# EAGLE design fonteauto4usb (EAGLE 4.16)
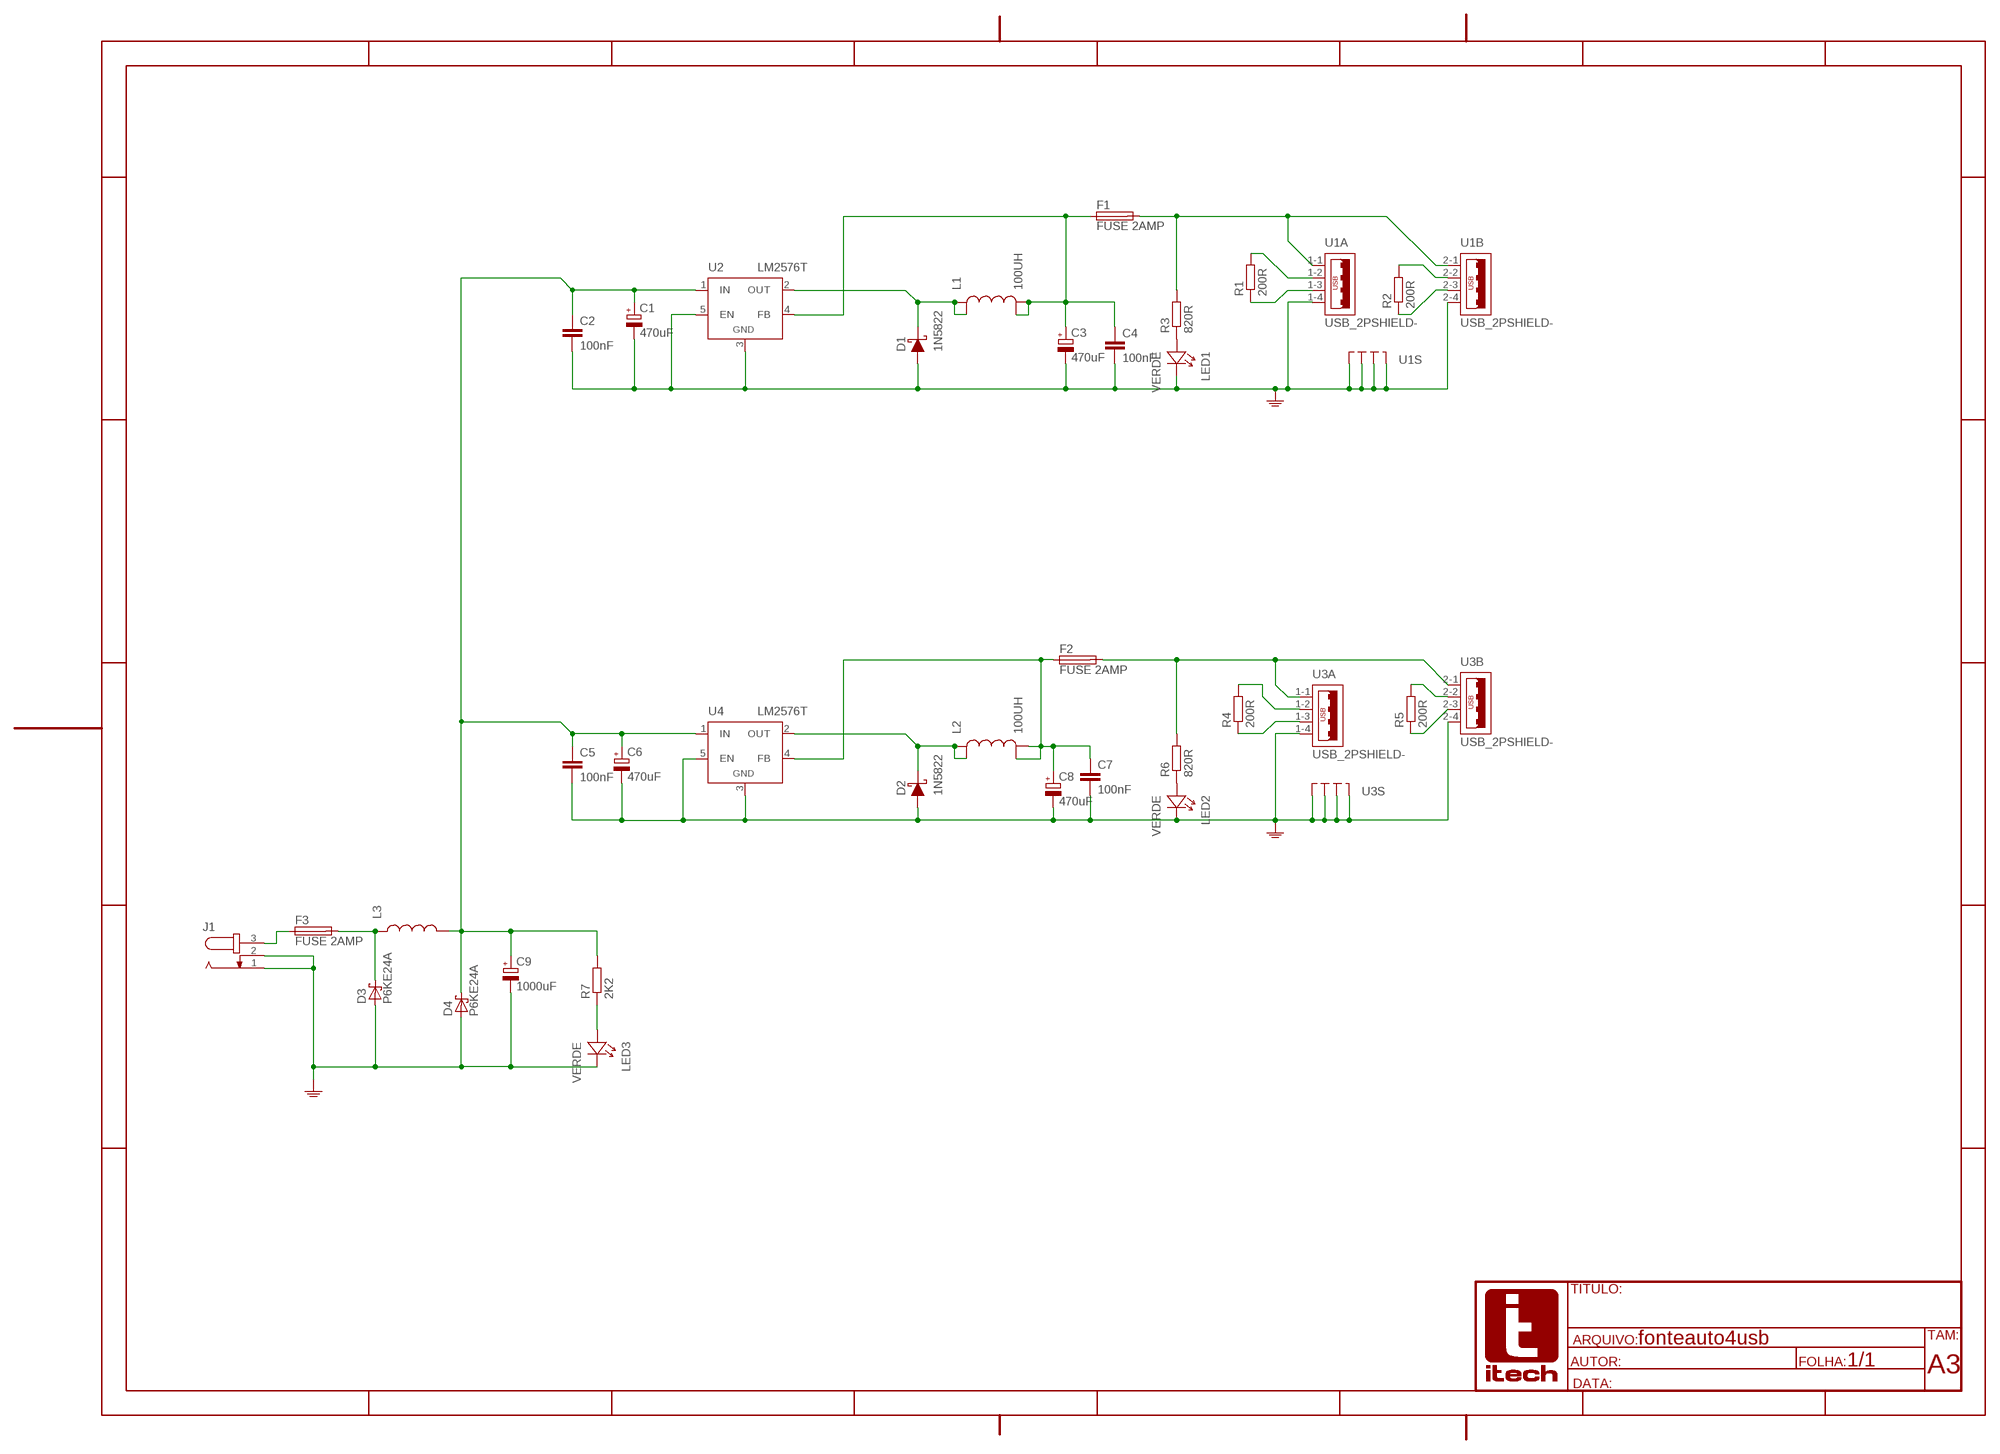
[diagram p0: schematic, sheet 1]

## Parts
C1  470uF  CPOL-EUE5-10.5  [E5-10,5]
C2  100nF  C-EU050-025X075  [C050-025X075]
C3  470uF  CPOL-EUE5-10.5  [E5-10,5]
C4  100nF  C-EU050-025X075  [C050-025X075]
C5  100nF  C-EU050-025X075  [C050-025X075]
C6  470uF  CPOL-EUE5-10.5  [E5-10,5]
C7  100nF  C-EU050-025X075  [C050-025X075]
C8  470uF  CPOL-EUE5-10.5  [E5-10,5]
C9  1000uF  CPOL-EUE5-10.5  [E5-10,5]
D1  1N5822  [DO201T15]
D2  1N5822  [DO201T15]
D3  P6KE24A  P6KEXXA  [C1702-15]
D4  P6KE24A  P6KEXXA  [C1702-15]
F1  FUSE 2AMP  FUSEKS9V  [KS9V]
F2  FUSE 2AMP  FUSEKS9V  [KS9V]
F3  FUSE 2AMP  FUSEKS9V  [KS9V]
J1  JACK-PLUG0  [SPC4077]
L1  100UH  [DS124]
L2  100UH  [DS124]
L3  PCV-2-103-5L  [PCV-2-103-5L]
LED1  VERDE  LED3MM  [LED3MM]
LED2  VERDE  LED3MM  [LED3MM]
LED3  VERDE  LED3MM  [LED3MM]
R1  200R  R-EU_0207/10  [0207/10]
R2  200R  R-EU_0207/10  [0207/10]
R3  820R  R-EU_0207/10  [0207/10]
R4  200R  R-EU_0207/10  [0207/10]
R5  200R  R-EU_0207/10  [0207/10]
R6  820R  R-EU_0207/10  [0207/10]
R7  2K2  R-EU_0207/10  [0207/10]
U1  USB_2PSHIELD-  [USB-2P]
U2  LM2576T  [TO220-51]
U3  USB_2PSHIELD-  [USB-2P]
U4  LM2576T  [TO220-51]

## Nets
GND: C1.- C2.2 C3.- C4.2 C5.2 C6.- C7.2 C8.- C9.- D1.A D2.A D3.A D4.A J1.1 J1.2 LED1.K LED2.K LED3.K U1.1-4 U1.2-4 U1.M1(S:S1) U1.M2(S:S2) U1.M3(S:S3) U1.M4(S:S4) U2.3(GND) U2.5(EN) U3.1-4 U3.2-4 U3.M1(S:S1) U3.M2(S:S2) U3.M3(S:S3) U3.M4(S:S4) U4.3(GND) U4.5(EN)
N$1: R2.2 U1.2-2
N$2: R2.1 U1.2-3
N$3: R1.1 U1.1-3
N$4: R1.2 U1.1-2
N$5: R5.1 U3.2-3
N$6: R5.2 U3.2-2
N$7: R4.1 U3.1-3
N$8: R4.2 U3.1-2
N$9: LED2.A R6.1
N$11: C7.1 C8.+ F2.1 L2.P$2 L2.P$4 U4.4(FB)
N$12: F3.1 J1.3
N$13: D2.C(K) L2.P$1 L2.P$3 U4.2(OUT)
N$14: C1.+ C2.1 C5.1 C6.+ C9.+ D4.C L3.2 R7.2 U2.1(IN) U4.1(IN)
N$15: F2.2 R6.2 U3.1-1 U3.2-1
N$16: D3.C F3.2 L3.1
N$17: F1.2 R3.2 U1.1-1 U1.2-1
N$18: LED3.A R7.1
N$19: LED1.A R3.1
N$26: C3.+ C4.1 F1.1 L1.P$2 L1.P$4 U2.4(FB)
N$28: D1.C(K) L1.P$1 L1.P$3 U2.2(OUT)

## Library data of the parts
C1 C3 C6 C8 C9 = rcl:CPOL-EU: POLARIZED CAPACITOR, European symbol
C2 C4 C5 C7 = rcl:C-EU: CAPACITOR, European symbol
D1 D2 = diodos:1N582*
D3 D4 = diode:P6KEXXA: DIODE transient-voltage suppressor
F1-F3 = fuse:FUSE: Fuse
J1 = con-jack:JACK-PLUG: DC POWER JACK Power Jack, DC, Right Angle, Through Hole, Rated 5A at 16VDC, PC Terminals Distributor: Farnell (www.Farnell.de) Drawing: 84N1161.pdf / 84N1162.pdf Manufacturer: SPC Technology (www.spctechnology.com) Type: SPC4077 / SPC 4078
L1 L2 = inductor-coilcraft:100UH
L3 = inductor-coilcraft:PCV-2-*
LED1-LED3 = leds:LED3MM: LED 3 MM
R1-R7 = rcl:R-EU_: RESISTOR, European symbol
U1 U3 = itech:USB_2PSHIELD-: Conector USB Type A Double Female 90°
U2 U4 = LM2XXX:LM2576T

## Board
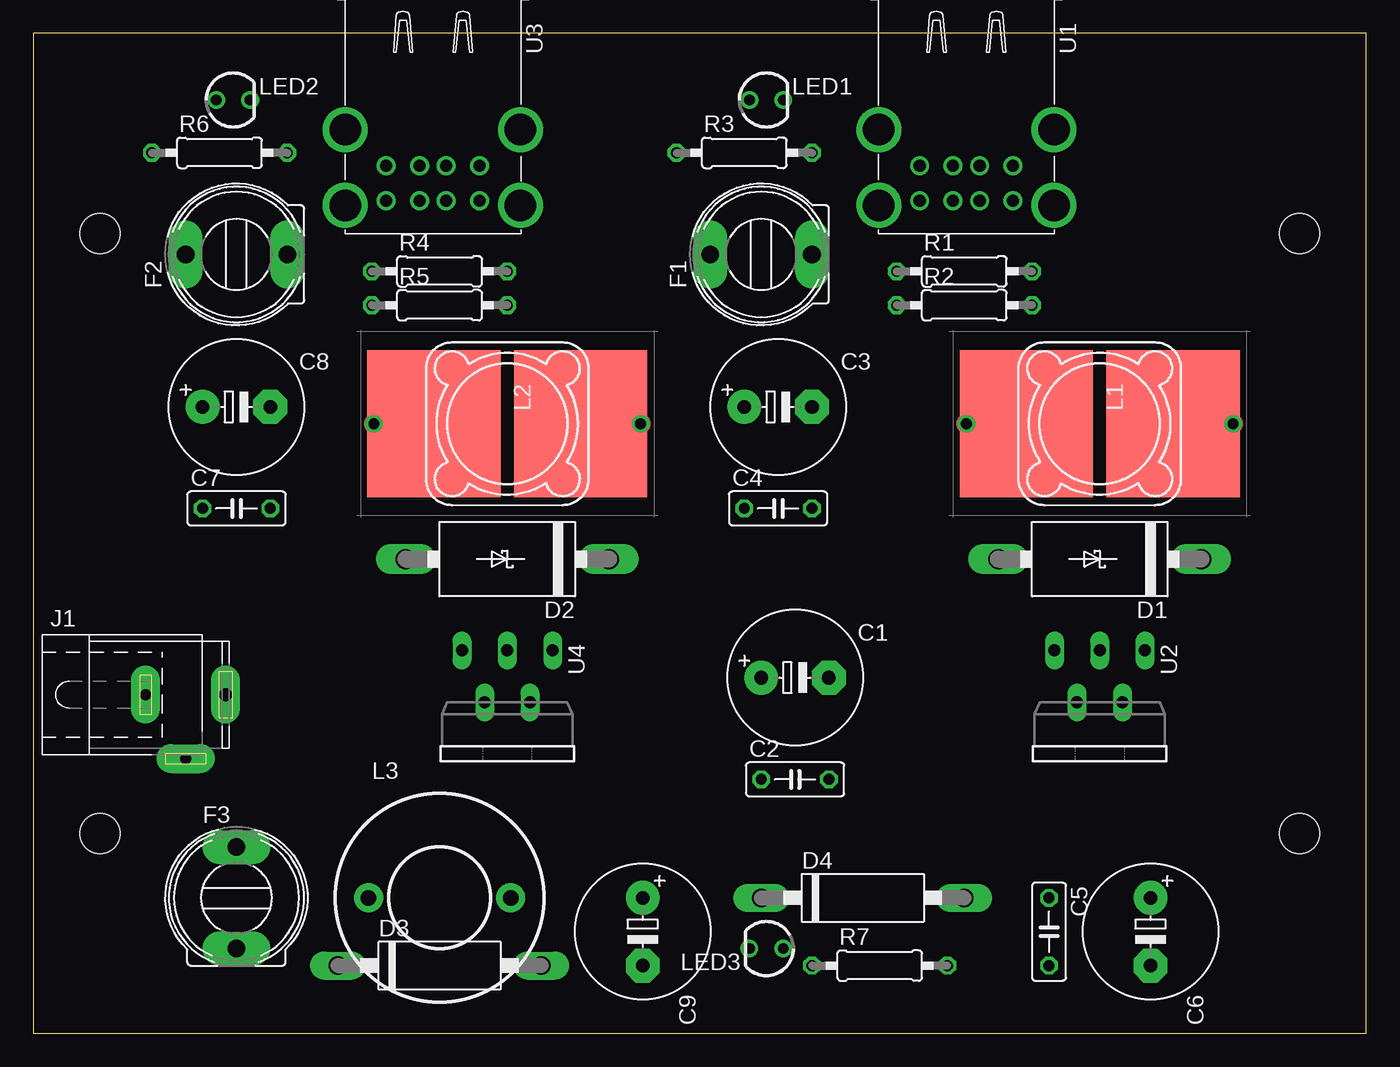
[diagram p1: board, top side]
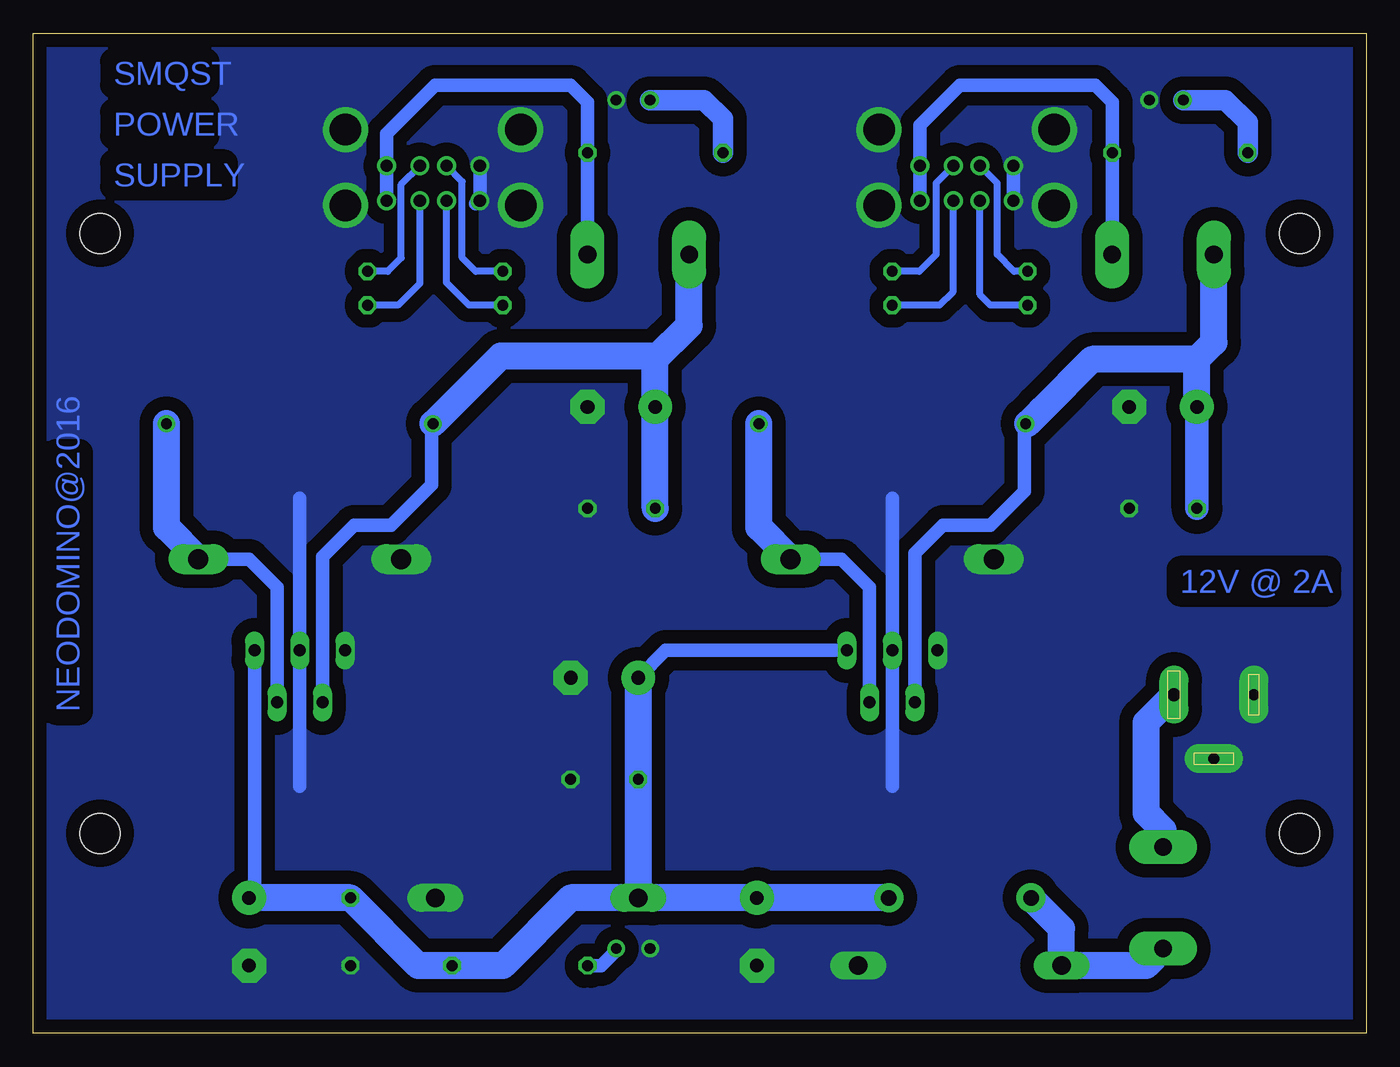
[diagram p2: board, bottom side, seen from below]

Size 100 x 75 mm. Coordinates in mm from the lower left corner, seen from the top.
Outline: 0,0 100,0 100,75 0,75 0,0
Copper layers (1*16): Top 0.035mm / dielectric 1.5mm / Bottom 0.035mm
Design rules "default": minimum track width 10mil, minimum drill 24mil, track to track 8mil, track to pad 8mil, pad to pad 8mil, via to via 8mil, smd to smd 8mil, copper to edge 40mil, drill to drill 8mil, minimum pad ring 10mil, minimum via ring 8mil, stop-mask expansion 4mil, vias tented up to drill 0mil, thermal gap 10mil
Holes 3 mm at 5,15 5,60 95,60 95,15

### Footprints (pad centres in the part's own frame; a part is rotated, then mirrored left to right if it is on the bottom)
E5-10,5 = drill 1.016 pad 2.54 round: + -2.54,0 | drill 1.016 pad 2.54 octagon: - 2.54,0
C050-025X075 = drill 0.813 octagon: 1 -2.54,0; 2 2.54,0
DO201T15 = drill 1.499 long: A 7.62,0; C -7.62,0
C1702-15 = drill 1.397 long: A 7.62,0; C -7.62,0
KS9V = drill 1.321 pad 2.54 long: 1 0,3.81; 2 0,-3.81
SPC4077 = drill 0.8 pad 2.184 long: 1 -3,0; 2 0,-4.8 | drill 1 pad 2.184 long: 3 3,0
DS124 = smd 11 x 10: P$1 0,5.5; P$2 0,-5.5 | drill 0.8 round: P$3 0,10; P$4 0,-10
PCV-2-103-5L = drill 1.168 pad 2.184 round: 1 -5.334,0; 2 5.334,0
LED3MM = drill 0.813 round: A -1.27,0; K 1.27,0
0207/10 = drill 0.813 octagon: 1 -5.08,0; 2 5.08,0
USB-2P = drill 0.914 pad 1.27 round: 1-1 1.44,3.5; 1-2 1.44,1; 1-3 1.44,-1; 1-4 1.44,-3.5; 2-1 4.06,3.5; 2-2 4.06,1; 2-3 4.06,-1; 2-4 4.06,-3.5 | drill 2.362 round: M1 -1.27,6.57; M2 -1.27,-6.57; M3 4.41,6.57; M4 4.41,-6.57
TO220-51 = drill 0.9 long: 1 -3.4,-8.4; 2 -1.7,-4.5; 3 0,-8.4; 4 1.7,-4.5; 5 3.4,-8.4

### Placement (x,y rotation side)
C1  57.15,26.67 0 top
C2  57.15,19.05 0 top
C3  55.88,46.99 0 top
C4  55.88,39.37 0 top
C5  76.2,7.62 270 top
C6  83.82,7.62 270 top
C7  15.24,39.37 0 top
C8  15.24,46.99 0 top
C9  45.72,7.62 270 top
D1  80.01,35.56 180 top
D2  35.56,35.56 180 top
D3  30.48,5.08 0 top
D4  62.23,10.16 0 top
F1  54.61,58.42 90 top
F2  15.24,58.42 90 top
F3  15.24,10.16 0 top
J1  11.43,25.4 0 top
L1  80.01,45.72 270 top
L2  35.56,45.72 270 top
L3  30.48,10.16 0 top
LED1  55,70 0 top
LED2  15,70 0 top
LED3  54.99,6.36 180 top
R1  69.85,57.15 0 top
R2  69.85,54.61 0 top
R3  53.34,66.04 0 top
R4  30.48,57.15 0 top
R5  30.48,54.61 0 top
R6  13.97,66.04 0 top
R7  63.5,5.08 0 top
U1  70,66.5 270 top
U2  80.01,20.32 180 top
U3  29.98,66.5 270 top
U4  35.56,20.32 180 top

### Tracks (layer width: path | path; a pad name or v marks a point on that pad's centre or on a via)
GND
  Bottom 1.016: 80.01,18.54 80.01,28.7 | 80.01,28.7 U2.3 | 35.56,18.54 U4.3 | U3.2-4 26.48,62.29 | 26.48,62.29 U3.1-4 | 26.48,62.29 26.42,62.23 | 66.59,62.44 66.8,62.23 | U1.2-4 66.59,62.44 | U1.1-4 66.5,62.53 66.59,62.44 | 35.56,28.96 35.56,40.13 | 80.01,28.7 80.01,40.13
  pour Bottom (isolate 1.016, no thermals): 0,0 100,0 100,75 0,75
N$1
  Bottom 0.508: U1.2-2 71,56.25 72.64,54.61 R2.2
N$2
  Bottom 0.508: U1.2-3 69,56.3 67.31,54.61 R2.1
N$3
  Bottom 0.508: U1.1-3 67.82,63.88 67.82,58.17 66.8,57.15 R1.1
N$4
  Bottom 0.508: U1.1-2 72.39,63.67 72.39,58.17 73.41,57.15 R1.2
N$5
  Bottom 0.508: U3.2-3 28.98,55.4 28.19,54.61 R5.1
N$6
  Bottom 0.508: U3.2-2 30.98,55.63 32,54.61 R5.2
N$7
  Bottom 0.508: U3.1-3 27.69,63.77 27.69,58.42 26.42,57.15 R4.1
N$8
  Bottom 0.508: U3.1-2 32.26,63.78 32.26,58.42 33.53,57.15 R4.2
N$9
  Bottom 1.524: LED2.A 10.56,70 8.89,68.33 R6.1
N$11
  Top 1.524: 30.48,45.72 L2.P$2 L2.P$4
  Bottom 1.016: U4.4 33.86,35.99 31.75,38.1 28.19,38.1 25.65,40.64 25.65,45.97 25.56,45.88 L2.P$4 25.4,45.72
  Bottom 1.778: C7.1 C8.+
  Bottom 2.032: 25.4,45.72 24.38,46.74 20.57,50.55 12.7,50.55 | C8.+ 12.7,50.55 | 12.7,50.55 11.43,51.82 F2.1
N$12
  Bottom 2.032: J1.3 16.51,23.32 16.51,16.51 15.24,15.24 F3.1
N$13
  Top 1.524: 40.64,45.72 L2.P$1 L2.P$3
  Bottom 1.016: U4.2 37.26,33.45 39.37,35.56 D2.C
  Bottom 2.032: L2.P$3 45.56,37.94 D2.C
N$14
  Bottom 1.016: U4.1 52.56,28.72 C1.+ | U2.1 83.41,10.57 C6.+
  Bottom 2.032: L3.2 C9.+ D4.C | D4.C C2.1 C1.+ | C6.+ C5.1 71.12,5.08 R7.2 64.77,5.08 59.69,10.16 D4.C
N$15
  Bottom 1.016: 33.48,68.12 U3.1-1 | F2.2 R6.2 19.05,69.85 20.32,71.12 30.48,71.12 33.48,68.12 | 33.48,68.12 U3.2-1
N$16
  Bottom 2.032: F3.2 16.51,5.08 D3.C 22.86,7.87 L3.1
N$17
  Bottom 1.016: U1.2-1 U1.1-1 73.5,67.47 72.9,68.07 69.85,71.12 59.69,71.12 58.42,69.85 R3.2 F1.2
N$18
  Bottom 1.016: LED3.A 56.14,6.36 56.13,6.35 57.4,5.08 R7.1
N$19
  Bottom 1.524: LED1.A 49.68,70 48.26,68.58 R3.1
N$26
  Top 1.524: 74.93,45.72 L1.P$2 L1.P$4
  Bottom 1.016: 69.85,45.72 L1.P$4 70.01,45.81 | U2.4 78.31,35.74 75.95,38.1 73.15,38.1 70.1,41.15 70.1,45.72 70.01,45.81 | 70.01,45.81 69.85,45.97
  Bottom 2.032: C4.1 C3.+ 53.34,50.55 | L1.P$4 64.93,50.8 53.34,50.8 53.34,50.55 | F1.1 50.8,53.09 53.34,50.55
N$28
  Top 1.524: 85.09,45.72 L1.P$1 L1.P$3
  Bottom 1.016: U2.2 81.71,33.45 83.82,35.56 D1.C
  Bottom 2.032: L1.P$3 90.01,37.94 D1.C

### Text on the board
Bottom: SMQST | POWER | SUPPLY | 12V @ 2A | NEODOMINO@2016